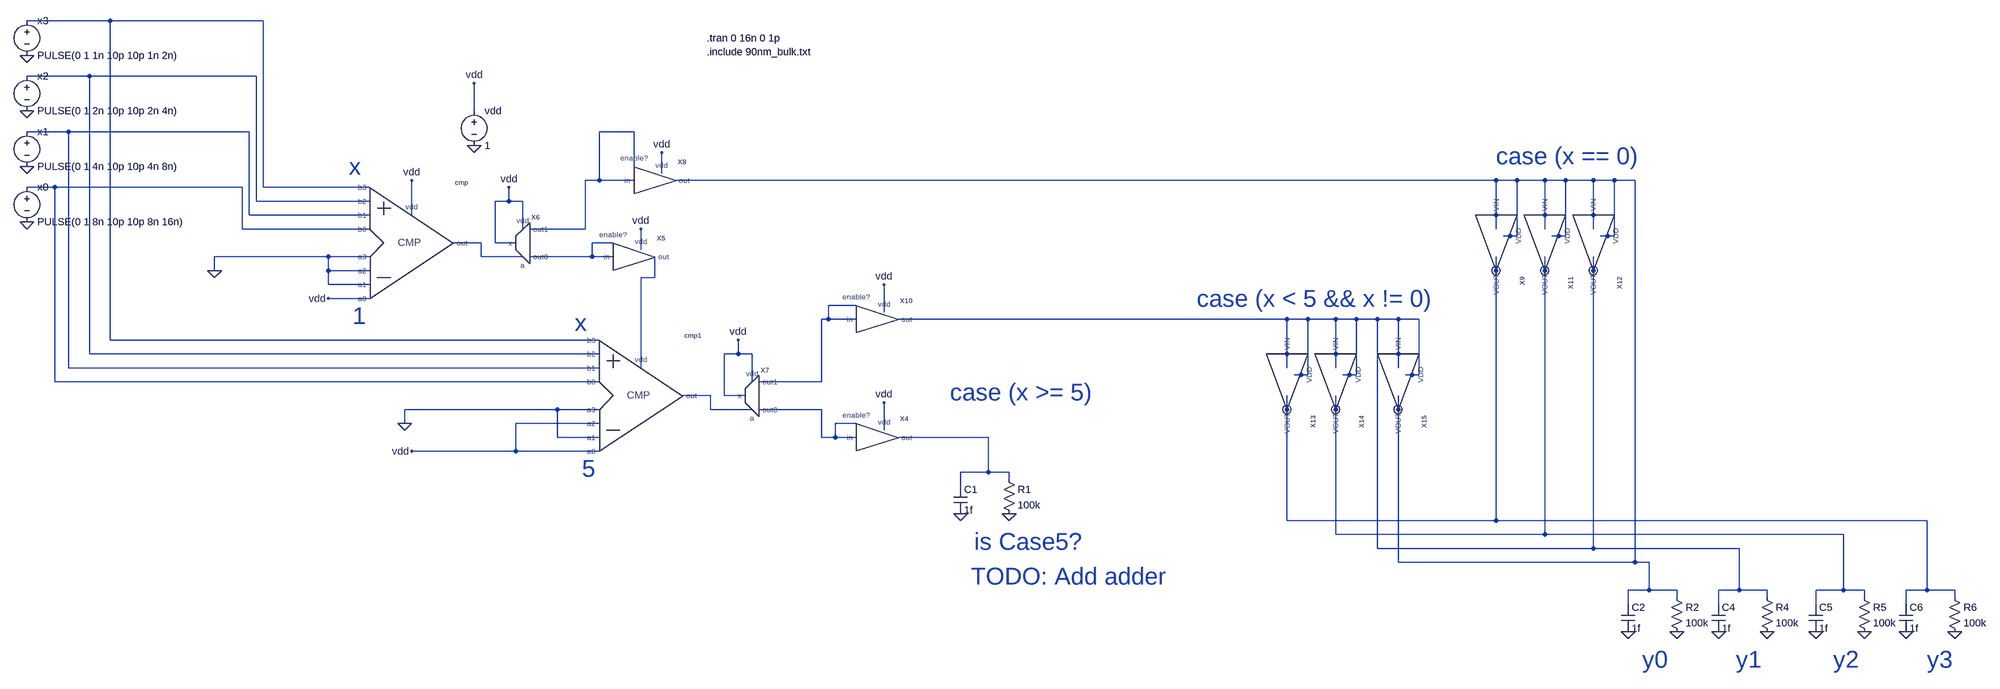
[diagram p0: schematic Formula2.asc]
Formula2.asc, the LTspice schematic file:
Version 4
SHEET 1 4228 1348
WIRE -320 -192 -512 -192
WIRE 32 -192 -320 -192
WIRE -368 -64 -512 -64
WIRE 16 -64 -368 -64
WIRE 608 16 608 -48
WIRE -416 64 -512 64
WIRE 0 64 -416 64
WIRE 976 64 896 64
WIRE 976 144 976 64
WIRE 1040 160 1040 112
WIRE 896 176 896 64
WIRE 896 176 864 176
WIRE 976 176 896 176
WIRE 3040 176 1072 176
WIRE 3088 176 3040 176
WIRE 3152 176 3088 176
WIRE 3200 176 3152 176
WIRE 3264 176 3200 176
WIRE 3312 176 3264 176
WIRE 3360 176 3312 176
WIRE -448 192 -512 192
WIRE -16 192 -448 192
WIRE 32 192 32 -192
WIRE 368 192 32 192
WIRE 16 224 16 -64
WIRE 368 224 16 224
WIRE 688 224 688 192
WIRE 688 224 656 224
WIRE 720 224 688 224
WIRE 0 256 0 64
WIRE 368 256 0 256
WIRE 464 256 464 176
WIRE -16 288 -16 192
WIRE 368 288 -16 288
WIRE 720 288 720 224
WIRE 864 288 864 176
WIRE 864 288 736 288
WIRE 3040 288 3040 176
WIRE 3152 288 3152 176
WIRE 3264 288 3264 176
WIRE 3088 304 3088 176
WIRE 3088 304 3056 304
WIRE 3200 304 3200 176
WIRE 3200 304 3168 304
WIRE 3312 304 3312 176
WIRE 3312 304 3280 304
WIRE 624 320 560 320
WIRE 656 320 656 224
WIRE 704 320 656 320
WIRE 928 320 880 320
WIRE 992 336 992 288
WIRE 272 352 -80 352
WIRE 368 352 272 352
WIRE 624 352 624 320
WIRE 720 352 624 352
WIRE 880 352 880 320
WIRE 880 352 736 352
WIRE 928 352 880 352
WIRE -80 384 -80 352
WIRE 272 384 272 352
WIRE 368 384 272 384
WIRE 1024 400 1024 352
WIRE 1024 400 992 400
WIRE 272 416 272 384
WIRE 368 416 272 416
WIRE 368 448 272 448
WIRE 1488 464 1424 464
WIRE 1552 480 1552 416
WIRE 1424 496 1424 464
WIRE 1424 496 1408 496
WIRE 1488 496 1424 496
WIRE 2480 496 1584 496
WIRE 2528 496 2480 496
WIRE 2592 496 2528 496
WIRE 2640 496 2592 496
WIRE 2688 496 2640 496
WIRE 2736 496 2688 496
WIRE 2784 496 2736 496
WIRE -320 544 -320 -192
WIRE 896 544 -320 544
WIRE -368 576 -368 -64
WIRE 896 576 -368 576
WIRE 1216 576 1216 544
WIRE 1216 576 1184 576
WIRE 1248 576 1216 576
WIRE -416 608 -416 64
WIRE 896 608 -416 608
WIRE 992 608 992 400
WIRE 2480 608 2480 496
WIRE 2592 608 2592 496
WIRE 2736 608 2736 496
WIRE 2528 624 2528 496
WIRE 2528 624 2496 624
WIRE 2640 624 2640 496
WIRE 2640 624 2608 624
WIRE 2784 624 2784 496
WIRE 2784 624 2752 624
WIRE -448 640 -448 192
WIRE 896 640 -448 640
WIRE 1248 640 1248 576
WIRE 1408 640 1408 496
WIRE 1408 640 1264 640
WIRE 1152 672 1088 672
WIRE 1184 672 1184 576
WIRE 1232 672 1184 672
WIRE 800 704 448 704
WIRE 896 704 800 704
WIRE 1152 704 1152 672
WIRE 1248 704 1152 704
WIRE 1408 704 1264 704
WIRE 448 736 448 704
WIRE 896 736 704 736
WIRE 1488 736 1440 736
WIRE 1552 752 1552 688
WIRE 800 768 800 704
WIRE 896 768 800 768
WIRE 1408 768 1408 704
WIRE 1440 768 1440 736
WIRE 1440 768 1408 768
WIRE 1488 768 1440 768
WIRE 1792 768 1584 768
WIRE 704 800 704 736
WIRE 704 800 464 800
WIRE 896 800 704 800
WIRE 1792 848 1792 768
WIRE 1792 848 1728 848
WIRE 1840 848 1792 848
WIRE 1840 864 1840 848
WIRE 1728 880 1728 848
WIRE 2480 960 2480 672
WIRE 3040 960 3040 352
WIRE 3040 960 2480 960
WIRE 4032 960 3040 960
WIRE 2592 992 2592 672
WIRE 3152 992 3152 352
WIRE 3152 992 2592 992
WIRE 3840 992 3152 992
WIRE 2688 1024 2688 496
WIRE 3264 1024 3264 352
WIRE 3264 1024 2688 1024
WIRE 3600 1024 3264 1024
WIRE 2736 1056 2736 672
WIRE 3360 1056 3360 176
WIRE 3360 1056 2736 1056
WIRE 3392 1056 3360 1056
WIRE 3392 1120 3392 1056
WIRE 3392 1120 3344 1120
WIRE 3456 1120 3392 1120
WIRE 3600 1120 3600 1024
WIRE 3600 1120 3552 1120
WIRE 3664 1120 3600 1120
WIRE 3840 1120 3840 992
WIRE 3840 1120 3776 1120
WIRE 3888 1120 3840 1120
WIRE 4032 1120 4032 960
WIRE 4032 1120 3984 1120
WIRE 4096 1120 4032 1120
WIRE 3456 1136 3456 1120
WIRE 3664 1136 3664 1120
WIRE 3888 1136 3888 1120
WIRE 4096 1136 4096 1120
WIRE 3344 1152 3344 1120
WIRE 3552 1152 3552 1120
WIRE 3776 1152 3776 1120
WIRE 3984 1152 3984 1120
FLAG -512 144 0
FLAG -512 272 0
FLAG -512 16 0
FLAG -512 -112 0
FLAG 608 96 0
FLAG -80 384 0
FLAG 608 -48 vdd
FLAG 272 448 vdd
FLAG 464 176 vdd
FLAG 688 192 vdd
FLAG 448 736 0
FLAG 464 800 vdd
FLAG 1216 544 vdd
FLAG 1040 112 vdd
FLAG 992 288 vdd
FLAG 3344 1216 0
FLAG 3456 1216 0
FLAG 1552 416 vdd
FLAG 1552 688 vdd
FLAG 3552 1216 0
FLAG 3664 1216 0
FLAG 3776 1216 0
FLAG 3888 1216 0
FLAG 3984 1216 0
FLAG 4096 1216 0
FLAG 1728 944 0
FLAG 1840 944 0
SYMBOL voltage -512 176 R0
WINDOW 123 0 0 Left 2
WINDOW 39 0 0 Left 2
SYMATTR InstName x0
SYMATTR Value PULSE(0 1 8n 10p 10p 8n 16n)
SYMBOL voltage -512 48 R0
WINDOW 123 0 0 Left 2
WINDOW 39 0 0 Left 2
SYMATTR InstName x1
SYMATTR Value PULSE(0 1 4n 10p 10p 4n 8n)
SYMBOL voltage -512 -80 R0
WINDOW 123 0 0 Left 2
WINDOW 39 0 0 Left 2
SYMATTR InstName x2
SYMATTR Value PULSE(0 1 2n 10p 10p 2n 4n)
SYMBOL voltage -512 -208 R0
WINDOW 123 0 0 Left 2
WINDOW 39 0 0 Left 2
SYMATTR InstName x3
SYMATTR Value PULSE(0 1 1n 10p 10p 1n 2n)
SYMBOL comparator 432 320 R0
SYMATTR InstName cmp
SYMBOL voltage 608 0 R0
WINDOW 123 0 0 Left 2
WINDOW 39 0 0 Left 2
SYMATTR InstName vdd
SYMATTR Value 1
SYMBOL demux2 720 320 R0
SYMATTR InstName X6
SYMBOL comparator 960 672 R0
SYMATTR InstName cmp1
SYMBOL demux2 1248 672 R0
SYMATTR InstName X7
SYMBOL res 3440 1120 R0
SYMATTR InstName R2
SYMATTR Value 100k
SYMBOL cap 3328 1152 R0
SYMATTR InstName C2
SYMATTR Value 1f
SYMBOL transmissionGate 1536 496 R0
SYMATTR InstName X10
SYMBOL transmissionGate 1536 768 R0
SYMATTR InstName X4
SYMBOL transmissionGate 976 352 R0
SYMATTR InstName X5
SYMBOL transmissionGate 1024 176 R0
SYMATTR InstName X8
SYMBOL res 3648 1120 R0
SYMATTR InstName R4
SYMATTR Value 100k
SYMBOL cap 3536 1152 R0
SYMATTR InstName C4
SYMATTR Value 1f
SYMBOL res 3872 1120 R0
SYMATTR InstName R5
SYMATTR Value 100k
SYMBOL cap 3760 1152 R0
SYMATTR InstName C5
SYMATTR Value 1f
SYMBOL res 4080 1120 R0
SYMATTR InstName R6
SYMATTR Value 100k
SYMBOL cap 3968 1152 R0
SYMATTR InstName C6
SYMATTR Value 1f
SYMBOL inverter 3040 304 R90
SYMATTR InstName X9
SYMBOL inverter 3152 304 R90
SYMATTR InstName X11
SYMBOL inverter 3264 304 R90
SYMATTR InstName X12
SYMBOL inverter 2480 624 R90
SYMATTR InstName X13
SYMBOL inverter 2592 624 R90
SYMATTR InstName X14
SYMBOL inverter 2736 624 R90
SYMATTR InstName X15
SYMBOL res 1824 848 R0
SYMATTR InstName R1
SYMATTR Value 100k
SYMBOL cap 1712 880 R0
SYMATTR InstName C1
SYMATTR Value 1f
TEXT 1144 -120 Left 2 !.include 90nm_bulk.txt
TEXT 1144 -152 Left 2 !.tran 0 16n 0 1p
TEXT 328 488 Left 5 ;1
TEXT 320 144 Left 5 ;x
TEXT 856 840 Left 5 ;5
TEXT 840 504 Left 5 ;x
TEXT 3376 1280 Left 5 ;y0
TEXT 3592 1280 Left 5 ;y1
TEXT 3816 1280 Left 5 ;y2
TEXT 4032 1280 Left 5 ;y3
TEXT 3040 120 Left 5 ;case (x == 0)
TEXT 2272 448 Left 5 ;case (x < 5 && x != 0)
TEXT 1704 664 Left 5 ;case (x >= 5)
TEXT 1760 1008 Left 5 ;is Case5?
TEXT 1752 1088 Left 5 ;TODO: Add adder

The netlist it stands for:
* Formula2.asc
V§x0 N006 0 PULSE(0 1 8n 10p 10p 8n 16n)
V§x1 N003 0 PULSE(0 1 4n 10p 10p 4n 8n)
V§x2 N002 0 PULSE(0 1 2n 10p 10p 2n 4n)
V§x3 N001 0 PULSE(0 1 1n 10p 10p 1n 2n)
Xcmp N006 N003 N002 N001 vdd 0 0 0 vdd N007 comparator  ; pins b0 b1 b2 b3 a0 a1 a2 a3 vdd out
vdd vdd 0 1
XX6 vdd N007 N008 N004 vdd demux2  ; pins x a out0 out1 vdd
Xcmp1 N006 N003 N002 N001 vdd 0 vdd 0 N009 N012 comparator  ; pins b0 b1 b2 b3 a0 a1 a2 a3 vdd out
XX7 vdd N012 N013 N010 vdd demux2  ; pins x a out0 out1 vdd
R2 N005 0 100k
C2 N005 0 1f
XX10 N010 N011 vdd N010 transmissionGate  ; pins in out vdd enable?
XX4 N013 N014 vdd N013 transmissionGate  ; pins in out vdd enable?
XX5 N008 N009 vdd N008 transmissionGate  ; pins in out vdd enable?
XX8 N004 N005 vdd N004 transmissionGate  ; pins in out vdd enable?
R4 N011 0 100k
C4 N011 0 1f
R5 N016 0 100k
C5 N016 0 1f
R6 N015 0 100k
C6 N015 0 1f
XX9 N005 N015 N005 inverter  ; pins VDD VOUT VIN
XX11 N005 N016 N005 inverter  ; pins VDD VOUT VIN
XX12 N005 N011 N005 inverter  ; pins VDD VOUT VIN
XX13 N011 N015 N011 inverter  ; pins VDD VOUT VIN
XX14 N011 N016 N011 inverter  ; pins VDD VOUT VIN
XX15 N011 N005 N011 inverter  ; pins VDD VOUT VIN
R1 N014 0 100k
C1 N014 0 1f
.include 90nm_bulk.txt
.tran 0 16n 0 1p
* 1
* x
* 5
* x
* y0
* y1
* y2
* y3
* case (x == 0)
* case (x < 5 && x != 0)
* case (x >= 5)
* is Case5?
* TODO: Add adder
.backanno
.end